# EAGLE design JMP_2_0 (EAGLE 8.3.2)
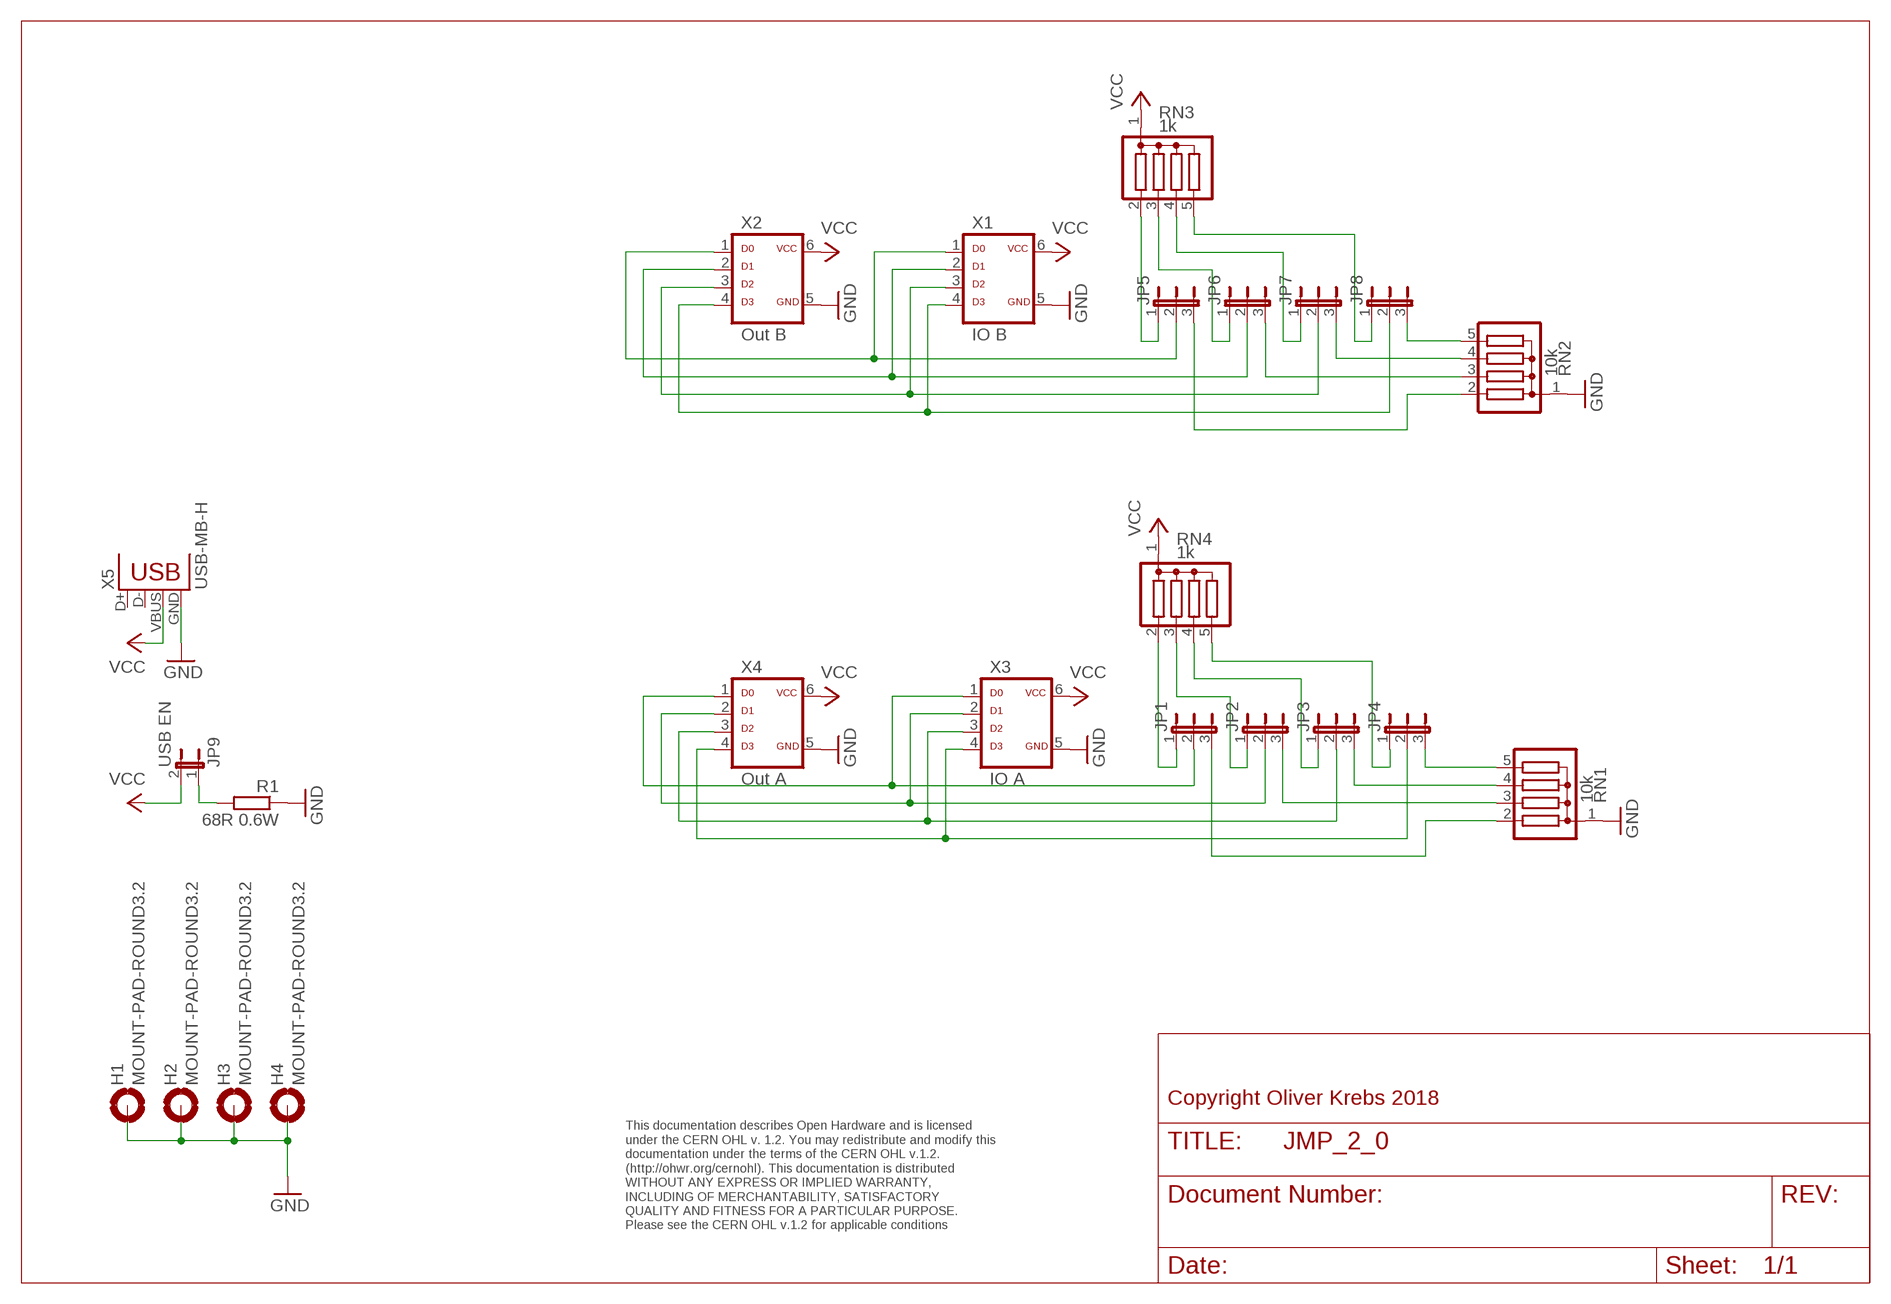
[diagram p0: schematic, sheet 1]

## Parts
H1  MOUNT-PAD-ROUND3.2  [3,2-PAD]
H2  MOUNT-PAD-ROUND3.2  [3,2-PAD]
H3  MOUNT-PAD-ROUND3.2  [3,2-PAD]
H4  MOUNT-PAD-ROUND3.2  [3,2-PAD]
JP1  JP2E  [JP2-S]
JP2  JP2E  [JP2-S]
JP3  JP2E  [JP2-S]
JP4  JP2E  [JP2-S]
JP5  JP2E  [JP2-S]
JP6  JP2E  [JP2-S]
JP7  JP2E  [JP2-S]
JP8  JP2E  [JP2-S]
JP9  USB EN  JP1E  [JP1]
R1  68R 0.6W  R-EU_0207/10  [0207/10]
RN1  10k  G04R  [SIL5]
RN2  10k  G04R  [SIL5]
RN3  1k  G04R  [SIL5]
RN4  1k  G04R  [SIL5]
X1  IO B  ML6D  [ML-6]
X2  Out B  ML6D  [ML-6]
X3  IO A  ML6D  [ML-6]
X4  Out A  ML6D  [ML-6]
X5  USB-MB-H  [USB-MB-H]

## Nets
GND: H1.B3,2(MOUNT) H2.B3,2(MOUNT) H3.B3,2(MOUNT) H4.B3,2(MOUNT) R1.1 RN1.1 RN2.1 X1.5 X2.5 X3.5 X4.5 X5.GND
N$1: JP5.2 X1.1 X2.1
N$2: JP6.2 X1.2 X2.2
N$3: JP1.2 X3.1 X4.1
N$4: JP8.2 X1.4 X2.4
N$5: JP2.2 X3.2 X4.2
N$6: JP4.2 X3.4 X4.4
N$7: JP7.2 X1.3 X2.3
N$8: JP3.2 X3.3 X4.3
N$9: JP8.1 RN3.5
N$10: JP9.1 R1.2
N$11: JP5.1 RN3.2
N$12: JP6.1 RN3.3
N$13: JP7.1 RN3.4
N$14: JP1.1 RN4.2
N$15: JP2.1 RN4.3
N$16: JP3.1 RN4.4
N$17: JP4.1 RN4.5
N$18: JP5.3 RN2.2
N$19: JP6.3 RN2.3
N$20: JP7.3 RN2.4
N$21: JP8.3 RN2.5
N$23: JP4.3 RN1.5
N$24: JP3.3 RN1.4
N$25: JP2.3 RN1.3
N$26: JP1.3 RN1.2
VCC: JP9.2 RN3.1 RN4.1 X1.6 X2.6 X3.6 X4.6 X5.VBUS
Unconnected: X5.D+ X5.D-

## Notes on the sheet
- Copyright Oliver Krebs 2018
- This documentation describes Open Hardware and is licensed 
  under the CERN OHL v. 1.2. You may redistribute and modify this 
  documentation under the terms of the CERN OHL v.1.2. 
  (http://ohwr.org/cernohl). This documentation is distributed
  WITHOUT ANY EXPRESS OR IMPLIED WARRANTY, 
  INCLUDING OF MERCHANTABILITY, SATISFACTORY 
  QUALITY AND FITNESS FOR A PARTICULAR PURPOSE. 
  Please see the CERN OHL v.1.2 for applicable conditions

## Library data of the parts
H1-H4 = holes:MOUNT-PAD-ROUND: MOUNTING PAD, round
JP1-JP8 = 01-my-jumper:JP2E: JUMPER
JP9 = jumper:JP1E: JUMPER
R1 = 01-my_rcl:R-EU_: RESISTOR, European symbol
RN1-RN4 = resistor-sil:G04R: SIL RESISTOR; OC_FARNELL: unknown; OC_NEWARK: unknown
X1-X4 = 01-my-con:ML6D
X5 = SparkFun-Connectors:USB: USB Connectors USB-B-PTH is fully proven SKU : PRT-00139/CONN-08278 USB-miniB is fully proven SKU : PRT-00587 USB-A-PCB is untested. USB-A-H is throughly reviewed, but untested. Spark Fun Electronics SKU : PRT-00437 USB-B-SMT is throughly reviewed, but untested. Needs silkscreen touching up. USB-A-S has not been used/tested USB-MB-H has not been used/tested USB-MICROB has been used. CONN-09505

## Board
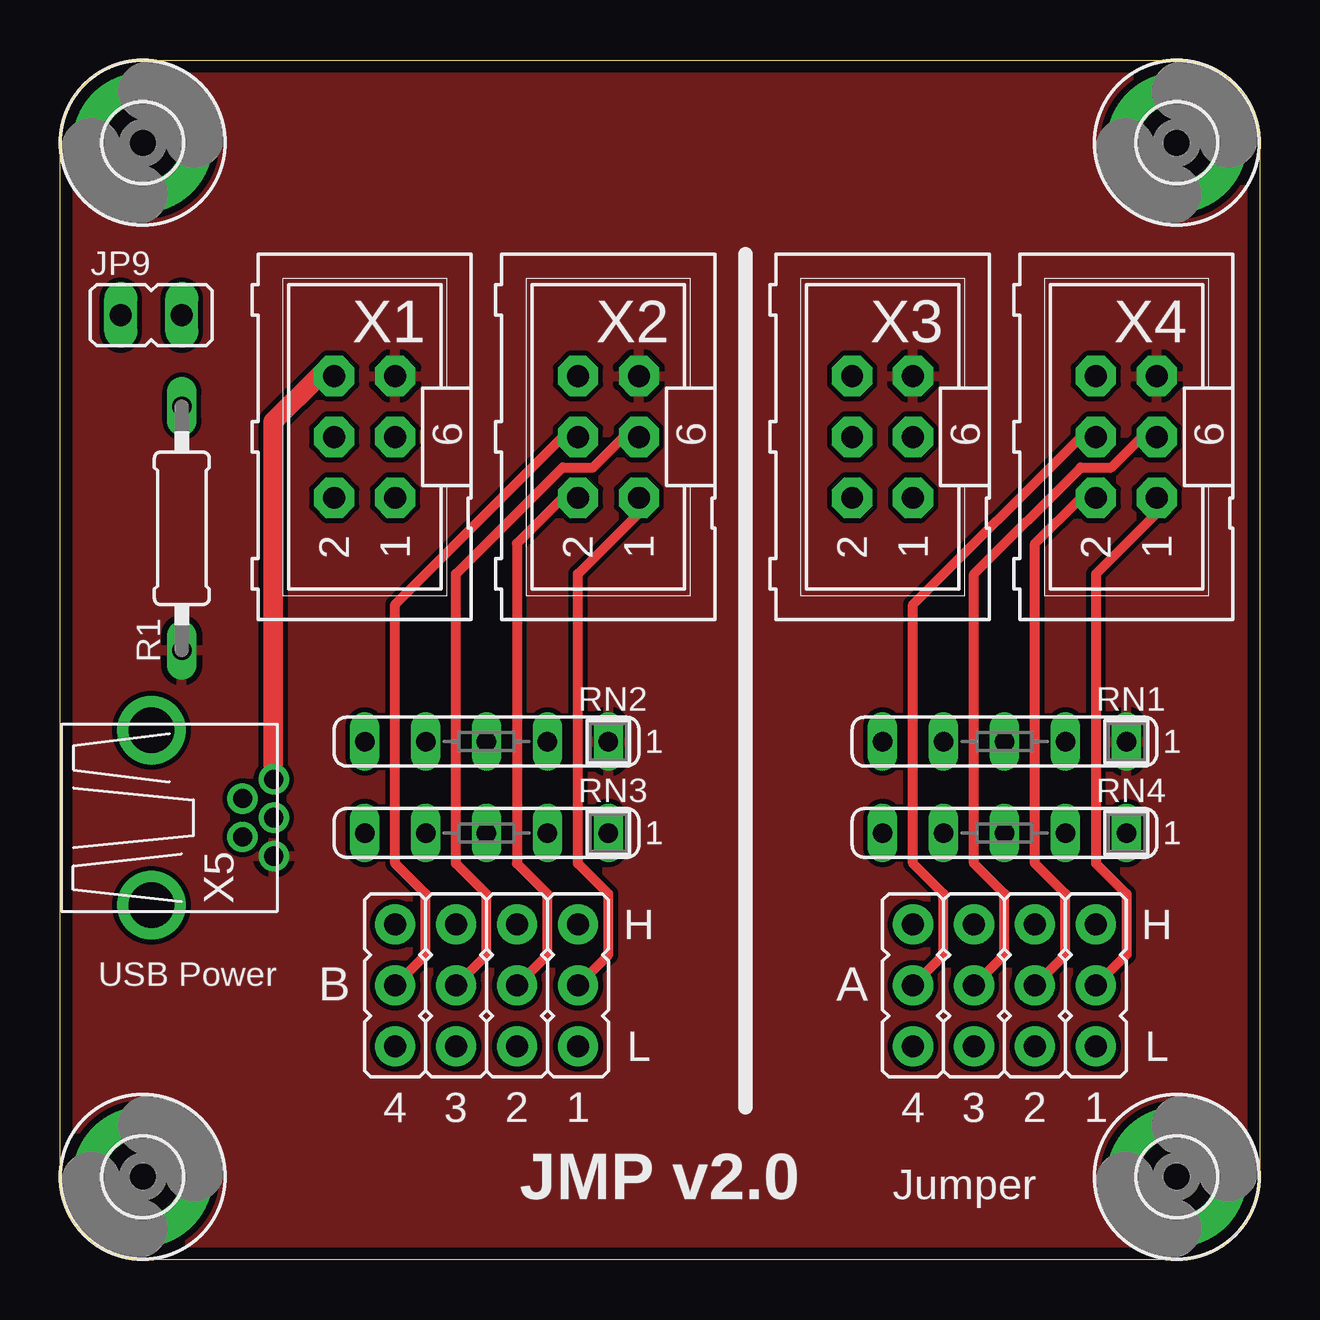
[diagram p1: board, top side]
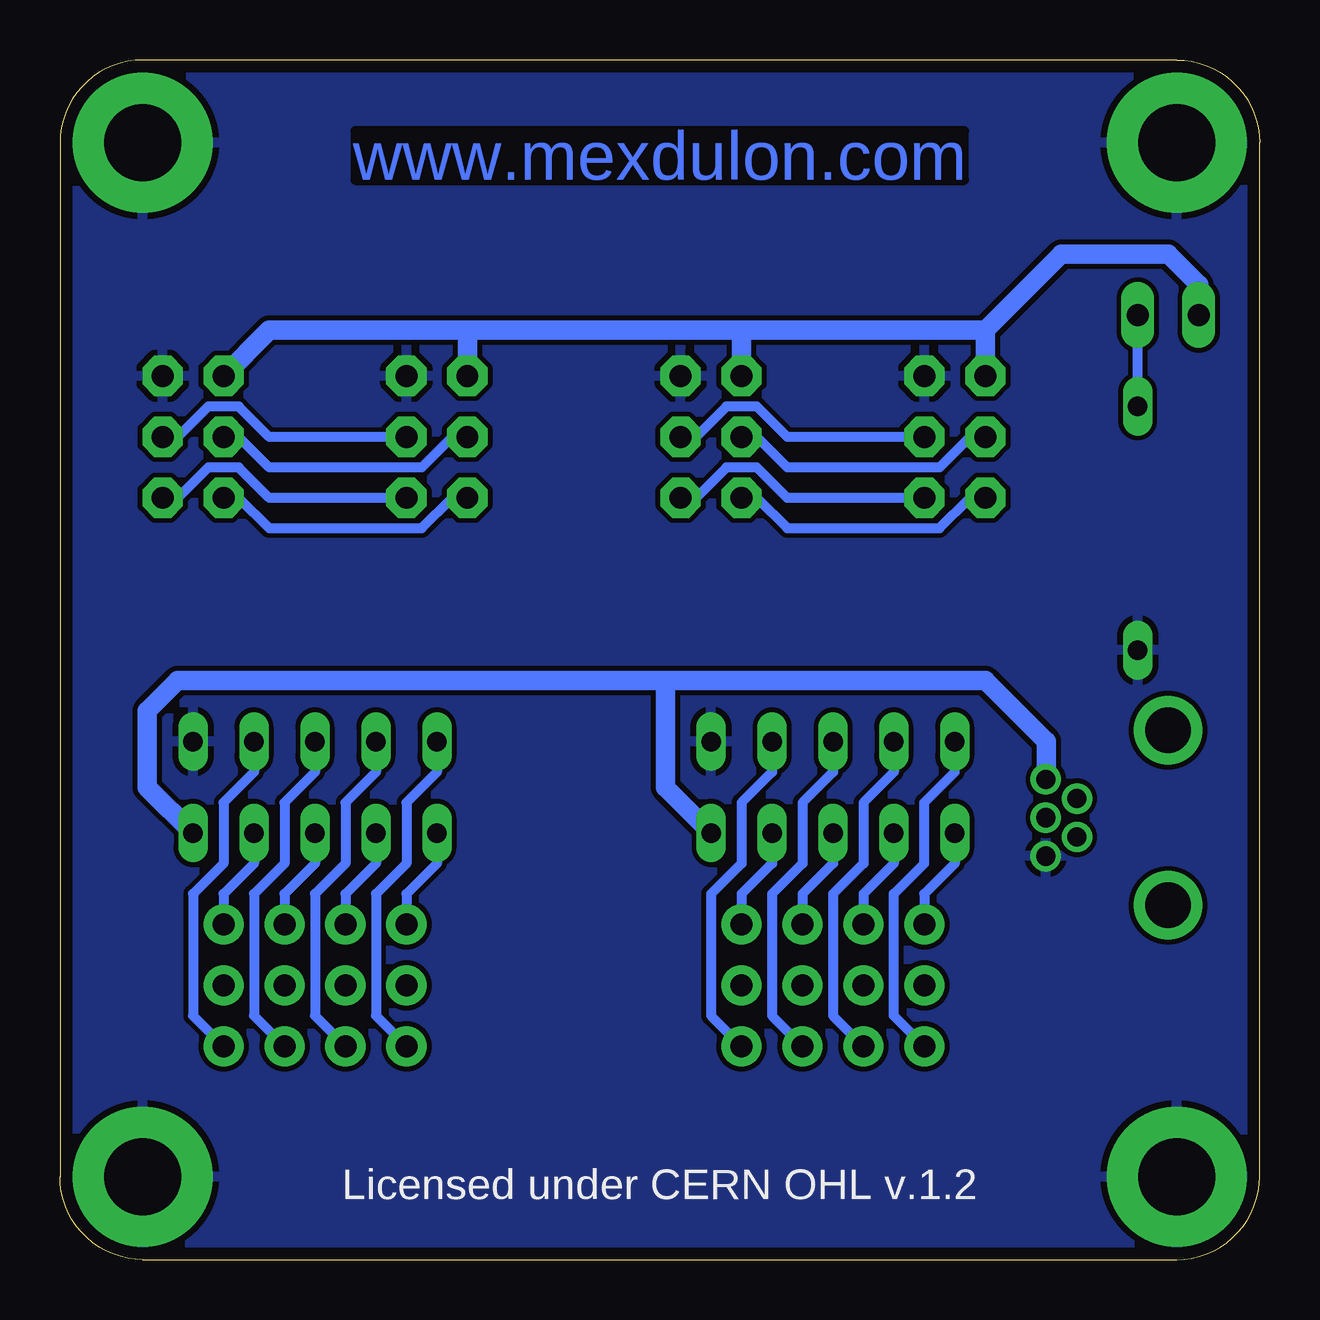
[diagram p2: board, bottom side, seen from below]

Size 50 x 50 mm. Coordinates in mm from the lower left corner, seen from the top.
Outline: 0,3.45 0,46.55 arc-90 3.45,50 46.55,50 arc-90 50,46.55 50,3.45 arc-90 46.55,0 3.45,0 arc-90 0,3.45
Copper layers (1*16): Top 0.035mm / dielectric 1.6mm / Bottom 0.035mm
Design rules "Elecrow_2-layer_PCB_eagle_rule": minimum track width 6mil, minimum drill 12mil, track to track 6mil, track to pad 6mil, pad to pad 6mil, via to via 8mil, smd to smd 0mil, copper to edge 20mil, drill to drill 10mil, minimum pad ring 6mil, minimum via ring 6mil, stop-mask expansion 0mil, vias tented up to drill 100mil, thermal gap 10mil

### Footprints (pad centres in the part's own frame; a part is rotated, then mirrored left to right if it is on the bottom)
3,2-PAD = drill 3.2 pad 5.842: B3,2 0,0
JP2-S = drill 0.914 pad 1.676: 1 -2.54,0; 2 0,0; 3 2.54,0
JP1 = drill 0.914 long: 1 0,-1.27; 2 0,1.27
0207/10 = drill 0.813 long: 1 -5.08,0; 2 5.08,0
SIL5 = drill 0.813 long: 1 -5.08,0; 2 -2.54,0; 3 0,0; 4 2.54,0; 5 5.08,0
ML-6 = drill 0.914 pad 1.676 octagon: 1 -2.54,-1.27; 2 -2.54,1.27; 3 0,-1.27; 4 0,1.27; 5 2.54,-1.27; 6 2.54,1.27
USB-MB-H = drill 0.8 pad 1.27: D+ 5.1,0; D- 3.8,0.8; GND 5.1,-1.6; ID 3.8,-0.8; VBUS 5.1,1.6 | drill 1.9: P$6 0,-3.65; P$7 0,3.65

### Placement (x,y rotation side)
H1  3.45,3.45 0 top
H2  3.45,46.55 0 top
H3  46.55,46.55 0 top
H4  46.55,3.45 0 top
JP1  43.18,11.43 270 top
JP2  40.64,11.43 270 top
JP3  38.1,11.43 270 top
JP4  35.56,11.43 270 top
JP5  21.59,11.43 270 top
JP6  19.05,11.43 270 top
JP7  16.51,11.43 270 top
JP8  13.97,11.43 270 top
JP9  3.81,39.37 90 top
R1  5.08,30.48 90 top
RN1  39.37,21.59 180 top
RN2  17.78,21.59 180 top
RN3  17.78,17.78 180 top
RN4  39.37,17.78 180 top
X1  12.7,34.29 90 top
X2  22.86,34.29 90 top
X3  34.29,34.29 90 top
X4  44.45,34.29 90 top
X5  3.81,18.41 0 top

### Tracks (layer width: path | path; a pad name or v marks a point on that pad's centre or on a via)
GND
  pour Bottom (isolate 0.203): 0,0 50.16,0 50.16,50.16 0,50.16
  pour Top (isolate 0.203): 0,50.16 50.16,50.16 50.16,0 0,0
N$1
  Top 0.406: JP5.2 22.86,12.7 22.86,15.24 21.59,16.51 21.59,28.57 24.13,31.11 X2.1
  Bottom 0.406: X1.1 19.68,31.75 20.95,33.02 22.23,33.02 23.5,31.75 X2.1
N$2
  Top 0.406: JP6.2 20.32,12.7 20.32,15.24 19.05,16.51 19.05,29.84 20.95,31.75 X2.2
  Bottom 0.406: X2.2 20.95,31.75 19.68,30.48 13.34,30.48 12.06,31.75 X1.2
N$3
  Top 0.406: X4.1 45.72,31.11 43.18,28.57 43.18,16.51 44.45,15.24 44.45,12.7 JP1.2
  Bottom 0.406: X3.1 41.27,31.75 42.55,33.02 43.81,33.02 45.09,31.75 X4.1
N$4
  Top 0.406: JP8.2 15.24,12.7 15.24,15.24 13.97,16.51 13.97,27.3 20.95,34.29 X2.4
  Bottom 0.406: X1.4 12.06,34.29 13.34,33.02 19.68,33.02 20.95,34.29 X2.4
N$5
  Top 0.406: JP2.2 41.91,12.7 41.91,15.24 40.64,16.51 40.64,29.84 42.55,31.75 X4.2
  Bottom 0.406: X4.2 42.55,31.75 41.27,30.48 34.92,30.48 33.66,31.75 X3.2
N$6
  Top 0.406: JP4.2 36.83,12.7 36.83,15.24 35.56,16.51 35.56,27.3 42.55,34.29 X4.4
  Bottom 0.406: X3.4 33.66,34.29 34.92,33.02 41.27,33.02 42.55,34.29 X4.4
N$7
  Top 0.406: JP7.2 17.78,12.7 17.78,15.24 16.51,16.51 16.51,28.57 20.95,33.02 22.23,33.02 23.5,34.29 X2.3
  Bottom 0.406: X1.3 19.68,34.29 20.95,35.56 22.23,35.56 23.5,34.29 X2.3
N$8
  Top 0.406: JP3.2 39.37,12.7 39.37,15.24 38.1,16.51 38.1,28.57 42.55,33.02 43.81,33.02 45.09,34.29 X4.3
  Bottom 0.406: X3.3 41.27,34.29 42.55,35.56 43.81,35.56 45.09,34.29 X4.3
N$9
  Bottom 0.406: RN3.5 12.7,16.51 13.97,15.24 JP8.1
N$10
  Bottom 0.406: R1.2 JP9.1
N$11
  Bottom 0.406: RN3.2 20.32,16.51 21.59,15.24 JP5.1
N$12
  Bottom 0.406: RN3.3 17.78,16.51 19.05,15.24 JP6.1
N$13
  Bottom 0.406: RN3.4 15.24,16.51 16.51,15.24 JP7.1
N$14
  Bottom 0.406: RN4.2 41.91,16.51 43.18,15.24 JP1.1
N$15
  Bottom 0.406: RN4.3 39.37,16.51 40.64,15.24 JP2.1
N$16
  Bottom 0.406: RN4.4 36.83,16.51 38.1,15.24 JP3.1
N$17
  Bottom 0.406: RN4.5 34.29,16.51 35.56,15.24 JP4.1
N$18
  Bottom 0.406: RN2.2 20.32,20.32 21.59,19.05 21.59,16.51 22.86,15.24 22.86,10.16 JP5.3
N$19
  Bottom 0.406: RN2.3 17.78,20.32 19.05,19.05 19.05,16.51 20.32,15.24 20.32,10.16 JP6.3
N$20
  Bottom 0.406: RN2.4 15.24,20.32 16.51,19.05 16.51,16.51 17.78,15.24 17.78,10.16 JP7.3
N$21
  Bottom 0.406: JP8.3 15.24,10.16 15.24,15.24 13.97,16.51 13.97,19.05 12.7,20.32 RN2.5
N$23
  Bottom 0.406: RN1.5 34.29,20.32 35.56,19.05 35.56,16.51 36.83,15.24 36.83,10.16 JP4.3
N$24
  Bottom 0.406: RN1.4 36.83,20.32 38.1,19.05 38.1,16.51 39.37,15.24 39.37,10.16 JP3.3
N$25
  Bottom 0.406: RN1.3 39.37,20.32 40.64,19.05 40.64,16.51 41.91,15.24 41.91,10.16 JP2.3
N$26
  Bottom 0.406: RN1.2 41.91,20.32 43.18,19.05 43.18,16.51 44.45,15.24 44.45,10.16 JP1.3
VCC
  Top 0.813: X1.6 10.79,36.83 8.89,34.92 8.89,20.04 X5.VBUS
  Bottom 0.813: RN3.1 24.77,19.68 24.77,24.13 | 24.77,24.13 11.43,24.13 8.89,21.59 8.89,20.04 X5.VBUS | 24.77,24.13 45.09,24.13 46.35,22.86 46.35,19.68 RN4.1 | JP9.2 2.54,40.64 3.81,41.91 8.26,41.91 11.43,38.73 | 11.43,38.73 X1.6 | 21.59,38.73 33.02,38.73 | 21.59,38.73 11.43,38.73 | 33.02,38.73 41.27,38.73 X4.6 | X3.6 33.02,38.73 | X2.6 21.59,38.73

### Text on the board
Bottom: www.mexdulon.com | www.mexdulon.com
tNames: H | H | USB Power | B | A | L | L | 4 | 3 | 2 | 1 | 4 | 3 | 2 | 1 | JMP v2.0 | Jumper
bNames: Licensed under CERN OHL v.1.2
200bmp: E:/Bilder/Elektronik/Modulion/Mexdulon/mexdulon_50x50_pcb.bmp